# Altium schematic sheet 06 USB.SchDoc
size 513 x 386 mm
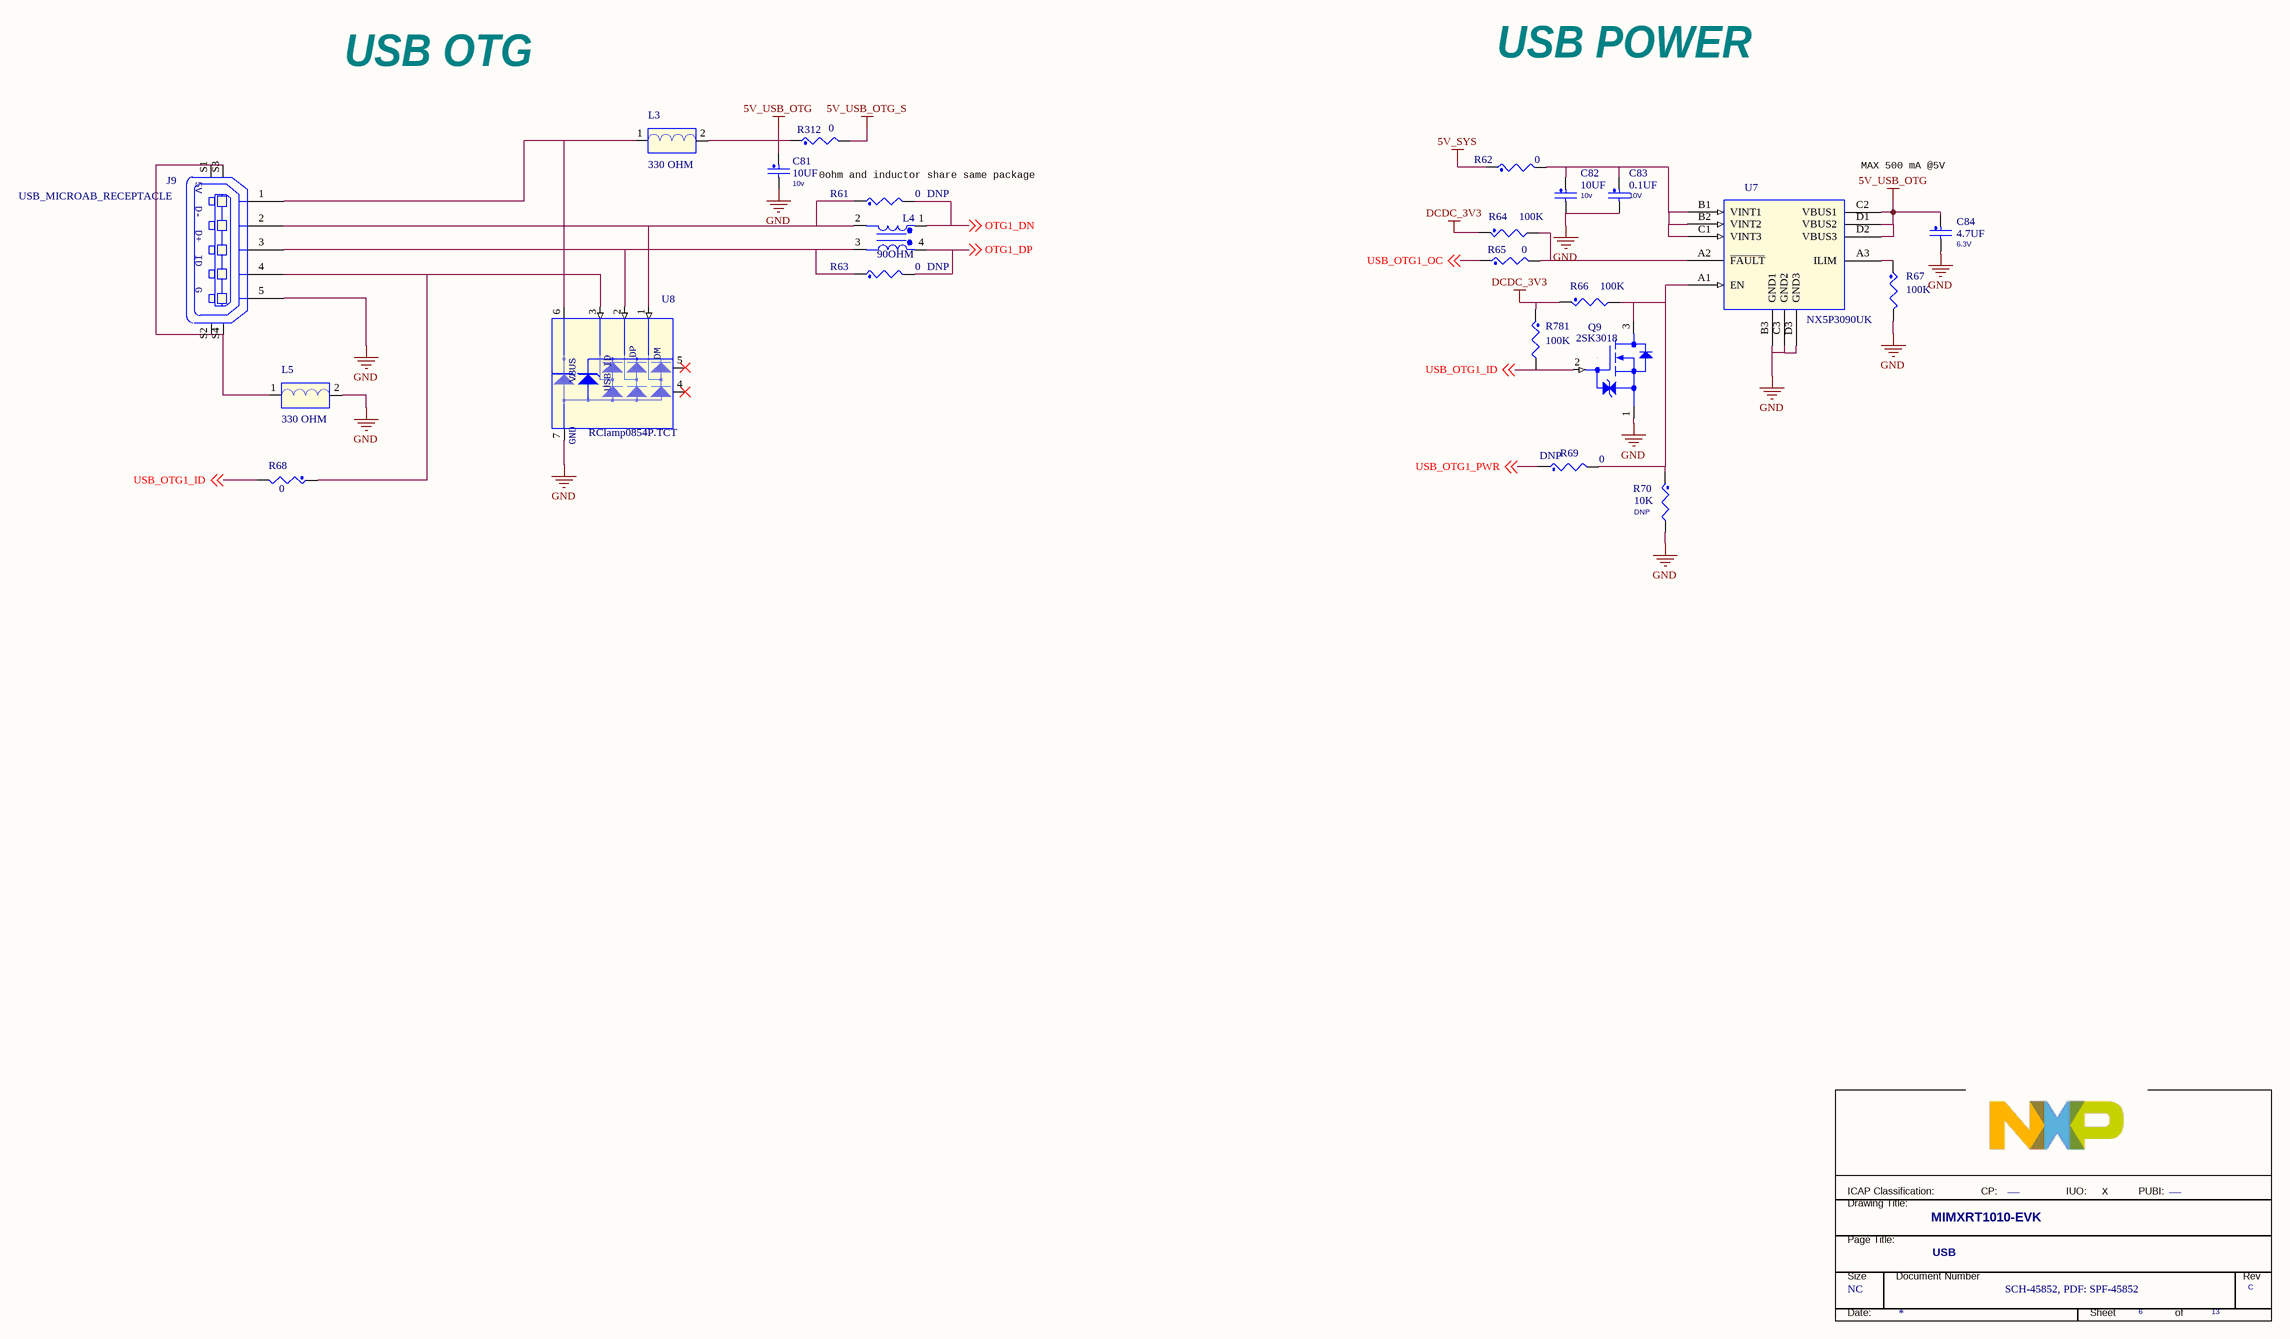
[diagram p0: 06 USB.SchDoc]

## Parts
*  PUBI: ___  Doc: SCH-45852, PDF: SPF-45852  RevCode: C  Title: MIMXRT1010-EVK  Page Size: NC  Page Number: 6  Page Count: 13  PageTitle: USB  (hidden comment: TitleBlock_FS)  (graphical)
C81  10UF  VOLTAGE: 10v  [CC0603_OV]
C82  10UF  VOLTAGE: 10v  [CC0603_OV]
C83  0.1UF  VOLTAGE: 10V  [CC0402_25]
C84  4.7UF  VOLTAGE: 6.3V  [0402_CC]
J9  USB_MICROAB_RECEPTACLE  [con_usb5_microab_0p65_sm]
L3  330 OHM  [ind_1608]
L4  90OHM  [ind4_choke_0805]
L5  330 OHM  [ind_1608]
Q9  2SK3018  [SOT323_3]
R61  0  ASSY_OPT: DNP  [0402_CC]
R62  0  [0402_CC]
R63  0  ASSY_OPT: DNP  [0402_CC]
R64  100K  [0402_CC]
R65  0  [0402_CC]
R66  100K  [0402_CC]
R67  100K  [RC0402_25]
R68  0  [0402_CC]
R69  0  ASSY_OPT: DNP  [0402_CC]
R70  10K  ASSY_OPT: DNP  [0402_CC]
R312  0  [0402_CC]
R781  100K  [0402_CC]
U7  NX5P3090UK  [wlcsp12_0p4_1p38x1p68mm_smdp]
U8  RClamp0854P.TCT  [slp1616p6]

## Nets
5V_SYS: R62.1
5V_USB_OTG: C81.1 C84.1 L3.2 R312.1 U7.C2(VBUS1) U7.D1(VBUS2) U7.D2(VBUS3)
5V_USB_OTG_S: R312.2
DCDC_3V3: R64.1 R66.1 R781.1
GND: C81.2 C82.2 C83.2 C84.2 J9.5(P5) L5.2 Q9.1(SOURCE) R67.2 R70.2 U7.B3(GND1) U7.C3(GND2) U7.D3(GND3) U8.7(GND)
OTG1_DN: L4.1 R61.2 ; off-sheet OTG1_DN
OTG1_DP: L4.4 R63.2 ; off-sheet OTG1_DP
USB_OTG1_ID: Q9.2(GATE) R68.2 R781.2 ; off-sheet USB_OTG1_ID
USB_OTG1_OC: R65.1 ; off-sheet USB_OTG1_OC
USB_OTG1_PWR: R69.1 ; off-sheet USB_OTG1_PWR
NetC82_1: C82.1 C83.1 R62.2 U7.B1(VINT1) U7.B2(VINT2) U7.C1(VINT3)
NetJ9_1: J9.1(P1) L3.1 U8.6(VBUS)
NetJ9_2: J9.2(P2) L4.2 R61.1 U8.1(DM)
NetJ9_3: J9.3(P3) L4.3 R63.1 U8.2(DP)
NetJ9_4: J9.4(P4) R68.1 U8.3(USB_ID)
NetJ9_S1: J9.S1(SHLD1) J9.S2(SHLD2) J9.S3(SHLD3) J9.S4(SHLD4) L5.1
NetQ9_3: Q9.3(DRAIN) R66.2 R69.2 R70.1 U7.A1(EN)
NetR64_2: R64.2 R65.2 U7.A2(~{FAULT})
NetR67_1: R67.1 U7.A3(ILIM)

Not connected (* = marked no-connect by the designer): U8 4(NC1)* 5(NC2)*

## Notes on the sheet
- USB OTG
- USB POWER
- 0ohm and inductor share same package
- MAX 500 mA @5V
- X
- (in symbol TitleBlock_FS) ICAP Classification:; CP:; IUO:; PUBI:; Drawing Title:; Page Title:; Size; Document Number; Rev; Date:; Sheet; of
- (in symbol USB_MINI_AB_RECEPTACLE) 5V; D-; D+; ID; G

## Library data of the parts
* = TitleBlock_FS: FIUO: _X_; OrgName: Freescale Semiconductor; OrgAddr1: 6501 William Cannon Drive West; OrgAddr2: Austin, TX 78735-8598; FCP: ___; Page Create Date: March  8, 1995; Page Modify Date: *
C81 = CAP_NP: CAP CER 10UF 10V 10% X5R 0603; CLASS: DISCRETE; AGILE_PN: 150-78675; MFG_NAME01: MURATA; MFG_PN01: GRM188R61A106KE69D; Temp_Range: -55¡ãC ~ 85¡ãC; CAD_APPROVED: Yes; FPLIST: CC0603_OV,CC0603,0603_CC; PCB Footprint: CC0603_OV; Tolerance: 10%; ROHS: Yes; HEIGHT: 1.016MM
C82 = CAP_NP: CAP CER 10UF 10V 10% X5R 0603; CLASS: DISCRETE; FPLIST: CC0603_OV,CC0603,0603_CC; CAD_APPROVED: Yes; Temp_Range: -55¡ãC ~ 85¡ãC; MFG_PN01: GRM188R61A106KE69D; MFG_NAME01: MURATA; AGILE_PN: 150-78675; PCB Footprint: CC0603_OV; HEIGHT: 1.016MM; ROHS: Yes; Tolerance: 10%
C83 = CAP_NP: CAP CER 0.1UF 10V 10% X5R 0402; CLASS: DISCRETE; AGILE_PN: 150-75634; MFG_NAME01: YAGEO AMERICA; MFG_PN01: CC0402KRX5R6BB104; CAD_APPROVED: Yes; FPLIST: CC0402_25,CC0402_HD,0402_CC; PCB Footprint: CC0402_25; Tolerance: 10%; ROHS: Yes; HEIGHT: 0.64MM
C84 = CAP_NP: CAP CER 4.7UF 6.3V 20% X5R 0402; CLASS: DISCRETE; FPLIST: CC0402_25,CC0402_HD,0402_CC; CAD_APPROVED: Yes; MFG_PN01: C1005X5R0J475M050BC; MFG_NAME01: TDK; AGILE_PN: 150-78463; PCB Footprint: 0402_CC; HEIGHT: 0.65MM; ROHS: Yes; Tolerance: 20%; TOL: 20%
J9 = USB_MINI_AB_RECEPTACLE: CON 5 USB MICRO_AB RA SKT SMT 0.65MM SP 110H AU; CLASS: IO; CAD_APPROVED: Yes; Temp_Range: -55&#8451; to 105&#8451;; MFG_PN01: 23971101#LCP-58RF; MFG_NAME01: ANYTRONIC CORPORATION LIMITED; AGILE_PN: 211-80104; PCB Footprint: con_usb5_microab_0p65_sm; HEIGHT: 2.8MM; ROHS: Yes
L3 = BEAD: IND FER BEAD 330OHM@100MHZ 1.7A 0603; PART_TYPE: FERRITE\BEAD; CLASS: DISCRETE; TOL: 25%; CAD_APPROVED: Yes; MFG_PN01: MPZ1608S331A; MFG_NAME01: TDK; AGILE_PN: 180-78156; PCB Footprint: ind_1608; HEIGHT: 0.95MM; ROHS: Yes; Tolerance: 25%
L4 = DLW43: IND CHK 90 OHM@100MHZ 330MA 25% 0805; PART_TYPE: CHOKE; CLASS: DISCRETE; AGILE_PN: 180-76336; MFG_NAME01: MURATA; MFG_PN01: DLW21HN900SQ2L; CAD_APPROVED: Yes; Temp_Range: -40¡ãC to +85¡ãC; PCB Footprint: ind4_choke_0805; Tolerance: 25%; ROHS: Yes; HEIGHT: 1MM
L5 = BEAD: IND FER BEAD 330OHM@100MHZ 1.7A 0603; PART_TYPE: FERRITE\BEAD; CLASS: DISCRETE; AGILE_PN: 180-78156; Tolerance: 25%; MFG_NAME01: TDK; MFG_PN01: MPZ1608S331A; CAD_APPROVED: Yes; PCB Footprint: ind_1608; ROHS: Yes; HEIGHT: 0.95MM; TOL: 25%
Q9 = 2SK3018: TRANS MOSFET N-CH 30V .1A SOT-323; CLASS: IC; AGILE_PN: 480-75317; MFG_NAME01: ROHM; MFG_PN01: 2SK3018T106; CAD_APPROVED: Yes; PCB Footprint: SOT323_3; ROHS: Yes; HEIGHT: 0.9MM
R61 R63 R68 R69 R312 = RES_Dup1: RES MF ZERO OHM 1/16W 5% 0402; CLASS: DISCRETE; FPLIST: RC0402_25,RC0402_HD,RC0402_X2,0402_CC; CAD_APPROVED: Yes; MFG_PN01: MCR01MZPJ000; MFG_NAME01: ROHM; AGILE_PN: 470-75394; PCB Footprint: 0402_CC; ROHS: Yes; Tolerance: 5%; HEIGHT: 0.45 MM
R62 R65 = RES_Dup1: RES MF ZERO OHM 1/16W 5% 0402; CLASS: DISCRETE; AGILE_PN: 470-75394; MFG_NAME01: ROHM; MFG_PN01: MCR01MZPJ000; CAD_APPROVED: Yes; FPLIST: RC0402_25,RC0402_HD,RC0402_X2,0402_CC; HEIGHT: 0.45 MM; Tolerance: 5%; ROHS: Yes; PCB Footprint: 0402_CC
R64 = RES_Dup1: RES MF 100K 1/16W 5% 0402; CLASS: DISCRETE; FPLIST: RC0402_25,RC0402_HD,0402_CC; CAD_APPROVED: Yes; MFG_PN01: CR0402-16W-104JT; MFG_NAME01: VENKEL COMPANY; AGILE_PN: 470-75597; Temp_Range: -55C to +155C; Tolerance: 5%; HEIGHT: 0.40 MM; ROHS: Yes; TOL: 5%; PCB Footprint: 0402_CC
R66 = RES_Dup1: RES MF 100K 1/16W 5% 0402; CLASS: DISCRETE; AGILE_PN: 470-75597; MFG_NAME01: VENKEL COMPANY; MFG_PN01: CR0402-16W-104JT; CAD_APPROVED: Yes; FPLIST: RC0402_25,RC0402_HD,0402_CC; Temp_Range: -55C to +155C; TOL: 5%; ROHS: Yes; HEIGHT: 0.40 MM; Tolerance: 5%; PCB Footprint: 0402_CC
R67 = RES_Dup1: RES MF 100K 1/16W 1% 0402; CLASS: DISCRETE; FPLIST: RC0402_25,RC0402_HD,0402_CC; CAD_APPROVED: Yes; MFG_PN01: NRCL04F1003TRF; MFG_NAME01: NIC COMPONENTS CORP; AGILE_PN: 470-76240; HEIGHT: 0.4MM; ROHS: Yes; Tolerance: 1%; PCB Footprint: RC0402_25
R70 = RES_Dup1: RES MF 10K 1/16W 5% 0402; CLASS: DISCRETE; AGILE_PN: 470-75557; MFG_NAME01: VISHAY INTERTECHNOLOGY; MFG_PN01: CRCW040210K0JNED; CAD_APPROVED: Yes; FPLIST: RC0402_25,RC0402_HD,0402_CC; PCB Footprint: 0402_CC; Tolerance: 5%; ROHS: Yes; HEIGHT: 0.4 MM
R781 = RES_Dup1: RES MF 100K 1/16W 5% 0402; CLASS: DISCRETE; Temp_Range: -55C to +155C; FPLIST: RC0402_25,RC0402_HD,0402_CC; CAD_APPROVED: Yes; MFG_PN01: CR0402-16W-104JT; MFG_NAME01: VENKEL COMPANY; AGILE_PN: 470-75597; PCB Footprint: 0402_CC; Tolerance: 5%; HEIGHT: 0.40 MM; ROHS: Yes; TOL: 5%
U7 = NX5P3090UK_WLCSP12: IC USB PD TYPE C CURRENT LIMITED PWR SW 2.5-5.5V WLCSP12; AGILE_PN: 312-81574; MFG_NAME01: NXP SEMICONDUCTORS; MFG_PN01: NX5P3090UK,012; CAD_APPROVED: Yes; CLASS: IC; ROHS: Yes; HEIGHT: 0.565 MM; PCB Footprint: wlcsp12_0p4_1p38x1p68mm_smdp
U8 = RCLAMP1654P_NEW: DIODE TVS ARRAY 3 5.5V SLP1616P6; CLASS: IC; CAD_APPROVED: Yes; MFG_NAME01: SEMTECH CORP; AGILE_PN: 480-78843; PCB Footprint: slp1616p6; HEIGHT: 0.65MM; ROHS: Yes; MFG_PN01: RClamp0854P.TCT